# EAGLE design simon_SMD (EAGLE 6.1)
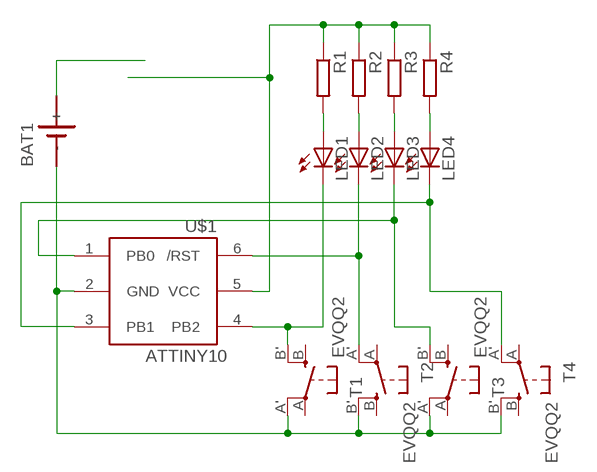
[diagram p0: schematic, sheet 1]

## Parts
BAT1  SN2032  [SN2032]
LED1  LEDCHIP-LED0805  [CHIP-LED0805]
LED2  LEDCHIP-LED0805  [CHIP-LED0805]
LED3  LEDCHIP-LED0805  [CHIP-LED0805]
LED4  LEDCHIP-LED0805  [CHIP-LED0805]
R1  R-EU_M0805  [M0805]
R2  R-EU_M0805  [M0805]
R3  R-EU_M0805  [M0805]
R4  R-EU_M0805  [M0805]
T1  EVQQ2  [EVQ-Q2]
T2  EVQQ2  [EVQ-Q2]
T3  EVQQ2  [EVQ-Q2]
T4  EVQQ2  [EVQ-Q2]
U$1  ATTINY10  [SOT23-6]

## Nets
N$1: LED4.A R4.2
N$2: LED3.A R3.2
N$3: LED2.A R2.2
N$4: LED1.A R1.2
N$5: LED2.C T2.A'(P1) U$1.6(/RST)
N$6: R1.1 R2.1 R3.1 R4.1 U$1.5(VCC)
N$7: LED1.C T1.B'(S1) U$1.4(PB2)
N$8: LED3.C T3.B'(S1) U$1.1(PB0)
N$9: LED4.C T4.A'(P1) U$1.3(PB1)
N$10: BAT1.- T1.A'(P1) T2.B'(S1) T3.A'(P1) T4.B'(S1) U$1.2(GND)
N$11: BAT1.+
Unconnected: T1.A(P) T1.B(S) T2.A(P) T2.B(S) T3.A(P) T3.B(S) T4.A(P) T4.B(S)

## Library data of the parts
BAT1 = sn2032:SN2032: LI BATTERY
LED1-LED4 = led:LED: LED OSRAM: - CHIPLED LG R971, LG N971, LY N971, LG Q971, LY Q971, LO R971, LY R971 LH N974, LH R974 LS Q976, LO Q976, LY Q976 LO Q996 - Hyper CHIPLED LW Q18S LB Q993, LB Q99A, LB R99A - SideLED LS A670, LO A670, LY A670, LG A670, LP A670 LB A673, LV A673, LT A673, LW A673 LH A674 LY A675 LS A676, LA A676, LO A676, LY A676, LW A676 LS A679, LY A679, LG A679 - Hyper Micro SIDELED® LS Y876, LA Y876, LO Y876, LY Y876 LT Y87S - SmartLED LW L88C, LW L88S LB L89C, LB L89S, LG L890 LS L89K, LO L89K, LY L89K LS L896, LA L896, LO L896, LY L896 - TOPLED LS T670, LO T670, LY T670, LG T670, LP T670 LSG T670, LSP T670, LSY T670, LOP T670, LYG T670 LG T671, LOG T671, LSG T671 LB T673, LV T673, LT T673, LW T673 LH T674 LS T676, LA T676, LO T676, LY T676, LB T676, LH T676, LSB T676, LW T676 LB T67C, LV T67C, LT T67C, LS T67K, LO T67K, LY T67K, LW E67C LS E67B, LA E67B, LO E67B, LY E67B, LB E67C, LV E67C, LT E67C LW T67C LS T679, LY T679, LG T679 LS T770, LO T770, LY T770, LG T770, LP T770 LB T773, LV T773, LT T773, LW T773 LH T774 LS E675, LA E675, LY E675, LS T675 LS T776, LA T776, LO T776, LY T776, LB T776 LHGB T686 LT T68C, LB T68C - Hyper Mini TOPLED® LB M676 - Mini TOPLED Santana® LG M470 LS M47K, LO M47K, LY M47K Source: http://www.osram.convergy.de LUXEON: - LUMILED® LXK2-PW12-R00, LXK2-PW12-S00, LXK2-PW14-U00, LXK2-PW14-V00 LXK2-PM12-R00, LXK2-PM12-S00, LXK2-PM14-U00 LXK2-PE12-Q00, LXK2-PE12-R00, LXK2-PE12-S00, LXK2-PE14-T00, LXK2-PE14-U00 LXK2-PB12-K00, LXK2-PB12-L00, LXK2-PB12-M00, LXK2-PB14-N00, LXK2-PB14-P00, LXK2-PB14-Q00 LXK2-PR12-L00, LXK2-PR12-M00, LXK2-PR14-Q00, LXK2-PR14-R00 LXK2-PD12-Q00, LXK2-PD12-R00, LXK2-PD12-S00 LXK2-PH12-R00, LXK2-PH12-S00 LXK2-PL12-P00, LXK2-PL12-Q00, LXK2-PL12-R00 Source: www.luxeon.com KINGBRIGHT: KA-3528ASYC Source: www.kingbright.com
R1-R4 = rcl:R-EU_: RESISTOR, European symbol
T1-T4 = adafruit_t10:EVQQ2: SMT 6mm switch, EVQQ2 series http://www.ladyada.net/library/eagle
U$1 = adafruit_t10:ATTINY10: ATtiny4/5/9/10 8-bit Microcontroller with 512/1024 Bytes In-System Programmable Flash

## Board
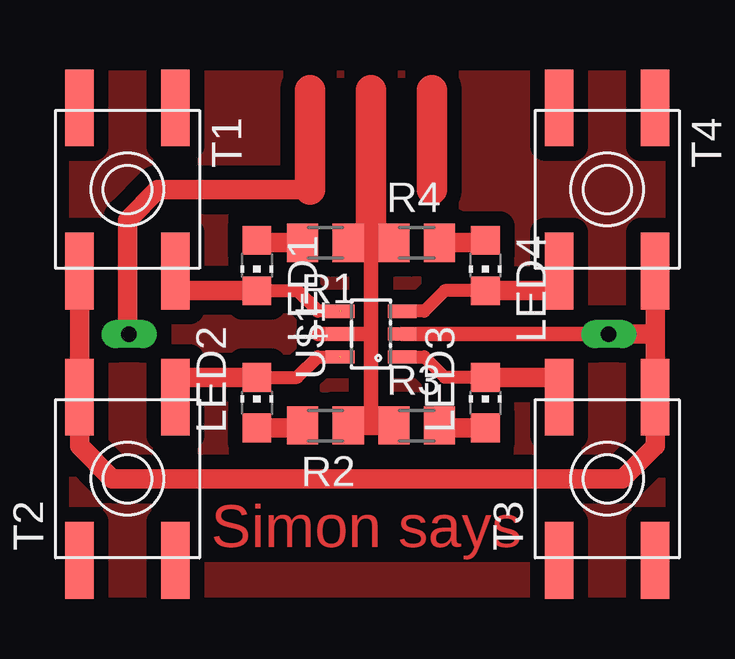
[diagram p1: board, top side]
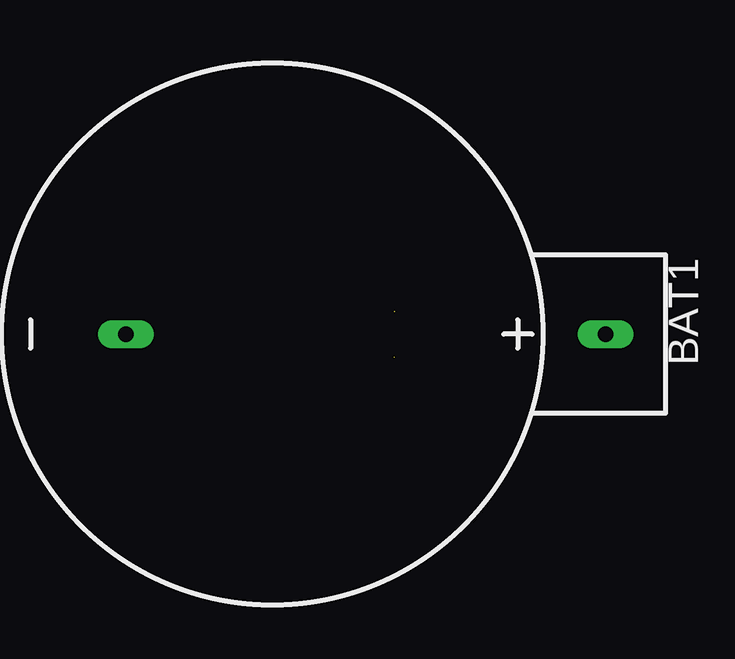
[diagram p2: board, bottom side, seen from below]

No outline drawn. Coordinates in mm, seen from the top.
Copper layers (1*16): Top 0.035mm / dielectric 1.5mm / Bottom 0.035mm
Design rules: minimum track width 10mil, minimum drill 24mil, track to track 8mil, track to pad 8mil, pad to pad 8mil, via to via 8mil, smd to smd 8mil, copper to edge 40mil, drill to drill 8mil, minimum pad ring 10mil, minimum via ring 8mil, stop-mask expansion 4mil, vias tented up to drill 0mil, thermal gap 10mil

### Footprints (pad centres in the part's own frame; a part is rotated, then mirrored left to right if it is on the bottom)
SN2032 = drill 0.65 long: + 0,13.9; - 0,-6.1
CHIP-LED0805 = smd 1.2 x 1.2: A 0,-1.05; C 0,1.05
M0805 = smd 1.3 x 1.6: 1 -0.95,0; 2 0.95,0
EVQ-Q2 = smd 3.2 x 1.2: A -3.4,-2; A' 3.4,-2; B -3.4,2; B' 3.4,2
SOT23-6 = smd 0.55 x 1.2: 1 -0.95,-1.3; 2 0,-1.3; 3 0.95,-1.3; 4 0.95,1.3; 5 0,1.3; 6 -0.95,1.3

### Placement (x,y rotation side)
BAT1  17.46,12.06 270 bottom
LED1  8.89,14.92 180 top
LED2  8.89,9.21 0 top
LED3  18.41,9.21 0 top
LED4  18.41,14.92 180 top
R1  11.75,15.88 180 top
R2  11.75,8.26 180 top
R3  15.56,8.26 0 top
R4  15.56,15.88 0 top
T1  3.49,18.1 270 top
T2  3.49,6.03 90 top
T3  23.5,6.03 90 top
T4  23.5,18.1 270 top
U$1  13.65,12.06 90 top

### Tracks (layer width: path | path; a pad name or v marks a point on that pad's centre or on a via)
N$1
  Top 0.813: R4.2 18.32,15.88 LED4.A
N$2
  Top 0.813: LED3.A 16.61,8.16 R3.2
N$3
  Top 0.813: LED2.A 10.7,8.16 R2.2
N$4
  Top 0.813: R1.2 8.99,15.88 LED1.A
N$5  (1 unrouted)
  Top 0.55: LED2.C 10.57,10.26 11.43,11.11 12.38,11.11
  Top 0.559: 5.5,10.26 5.4,10.16 5.4,9.53 T2.A'
  Top 0.813: 5.5,10.26 LED2.C 8.99,10.26
N$6
  Top 0.559: 13.65,15.88 R4.1
  Top 0.61: 13.65,8.26 13.65,12.06 | 13.65,12.06 U$1.5 11.43,12.06 | 13.65,12.06 13.65,15.88 R1.1
  Top 0.813: R3.1 13.65,8.26 R2.1
  Top 1.27: 13.65,15.88 13.65,22.23
N$7  (1 unrouted)
  Top 0.55: 8.99,13.87 10.57,13.87 11.43,13.02 12.38,13.02
  Top 0.559: 5.5,13.87 5.4,13.97 5.4,14.6 T1.B'
  Top 0.813: 5.5,13.87 LED1.C 8.99,13.87
N$8
  Top 0.55: U$1.1 15.87,11.12 16.73,10.26 LED3.C
  Top 0.559: 21.49,10.26 21.59,10.16 21.59,9.53 T3.B'
  Top 0.813: 21.49,10.26 LED3.C 18.32,10.26
N$9
  Top 0.55: 18.32,13.87 16.73,13.87 15.88,13.02 U$1.3
  Top 0.559: 21.49,13.87 21.59,13.97 21.59,14.6 T4.A'
  Top 0.813: 21.49,13.87 LED4.C 18.32,13.87
N$10
  Top 0.61: U$1.2 BAT1.-
  Top 0.813: T1.A' T2.B' 1.49,7.4 2.86,6.03 24.13,6.03 25.5,7.4 T3.A' 25.5,12.06 | T4.B' 25.5,12.06 | 25.5,12.06 BAT1.-
N$12
  Top 0.813: 3.49,12.06 3.49,16.83 4.76,18.1 11.11,18.1
  Top 1.27: 11.11,22.23 11.11,18.1
N$13
  Top 1.27: 16.19,18.1 16.19,22.23
N$14
  pour Top (isolate 0.61, no thermals): 1.27,22.86 25.72,22.86 25.72,1.27 1.27,1.27

### Text on the board
Top: Simon says